# Altium schematic sheet Sheet1.SchDoc
size A4; SheetNumber: 1; SheetTotal: 1
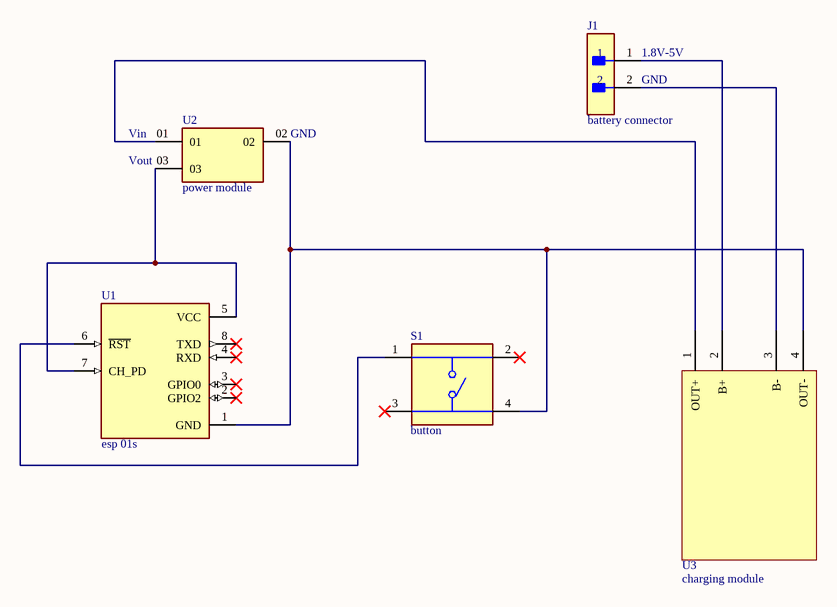
[diagram p0: Sheet1.SchDoc]

## Parts
J1  battery connector  [battery connector]
S1  button  [button]
U1  esp 01s  [esp 01s]
U2  power module  [power module]
U3  charging module  [charging module]

## Nets
NetJ1_1: J1.1 U3.2(B+)
NetJ1_2: J1.2 U3.3(B-)
NetS1_1: S1.1 U1.6(~{RST})
NetS1_4: S1.4 U1.1(GND) U2.02 U3.4(OUT-)
NetU1_5: U1.5(VCC) U1.7(CH_PD) U2.03
NetU2_01: U2.01 U3.1(OUT+)

Not connected (* = marked no-connect by the designer): S1 2* 3*; U1 2(GPIO2)* 3(GPIO0)* 4(RXD)* 8(TXD)*

## Notes on the sheet
- (near J1) 1.8V-5V
- (near J1) GND
- (near U2) Vin
- (near U2) Vout
- (near U2) GND